# EasyEDA schematic SCH_Bed sensor_2021-08-20.json
TITLE: Bed occupancy sensor; REV: 1.0; Date: 2021-07-02; Sheet: 1/1; Company: Bout sektor
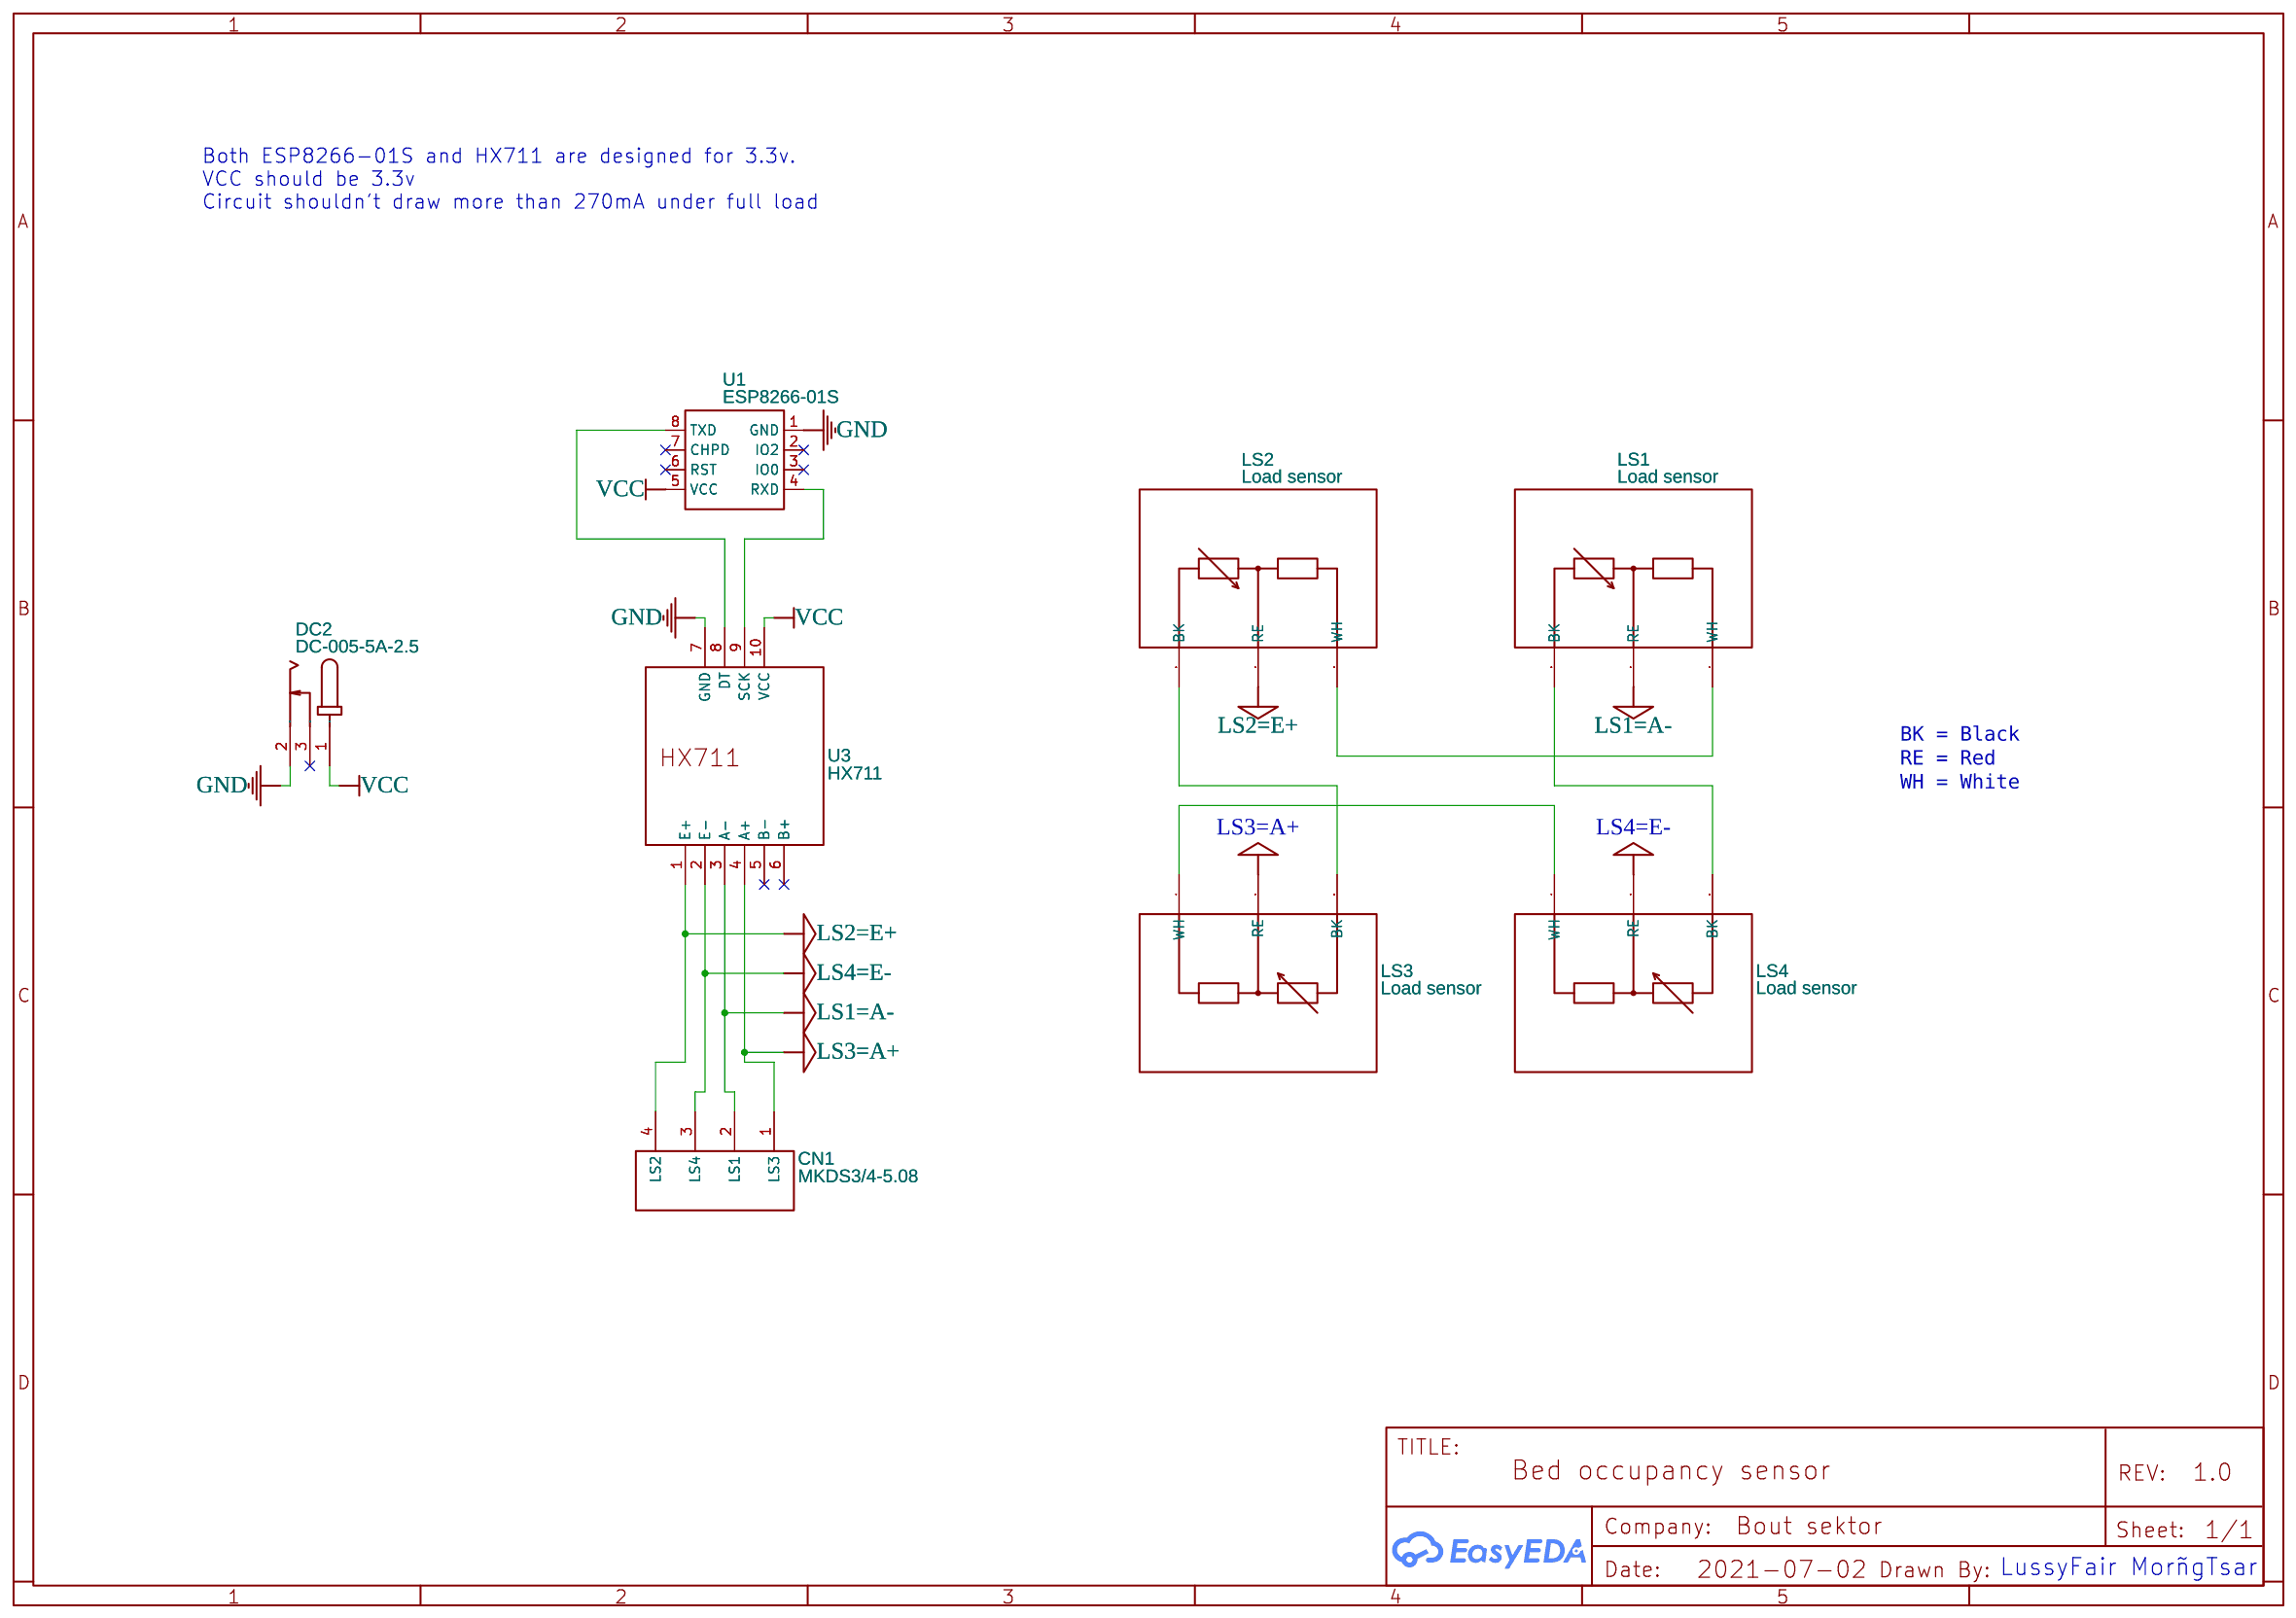
[diagram p0: schematic sheet]

## Parts
CN1  MKDS3/4-5.08  [CONN-TH_4P-P5.08_1712805]
DC2  DC-005-5A-2.5  [DC-IN-TH_DC-005-5A-2.5]
LS1  Load sensor  [CONN-TH_3P-P5.08_1711738]
LS2  Load sensor  [CONN-TH_3P-P5.08_1711738]
LS3  Load sensor  [CONN-TH_3P-P5.08_1711738]
LS4  Load sensor  [CONN-TH_3P-P5.08_1711738]
U1  ESP8266-01S  [ESP-01S]
U3  HX711  [SOP-16_L10.0-W3.9-P1.27-LS6.0-BL]

## Library data of the parts
CN1 = MKDS3/4-5.08: Supplier: LCSC; Manufacturer: Phoenix Contact; Supplier Part: C90087
DC2 = DC-005-5A-2.5: Supplier: LCSC; Supplier Part: C381115; Manufacturer: XKB Enterprise; Contributor: MarvinB
LS1 LS3 = Load sensor: Contributor: VHvozdik; Package Display: No
LS2 LS4 = Load sensor: Contributor: VHvozdik
U1 = ESP8266-01S: Supplier Part: C111009; Supplier: LCSC; Manufacturer: Ai-Thinker; Contributor: javierj
U3 = HX711: Supplier: LCSC; Manufacturer: AVIA; Supplier Part: C43656; Paste Type: Extended Part; JLCPCB Part Class: Extended Part; Contributor: CHAMPTECH

## Nets
GND: DC2.2 U1.1(GND) U3.7(GND)
VCC: DC2.1 U1.5(VCC) U3.10(VCC)
LS1=A-: CN1.2(LS1) LS1.2(RE) U3.3(A-)
LS2=E+: CN1.4(LS2) LS2.2(RE) U3.1(E+)
LS3=A+: CN1.1(LS3) LS3.2(RE) U3.4(A+)
LS4=E-: CN1.3(LS4) LS4.2(RE) U3.2(E-)
Net-(LS1-1): LS1.1(WH) LS2.1(WH)
Net-(LS1-3): LS1.3(BK) LS4.3(BK)
Net-(LS2-3): LS2.3(BK) LS3.3(BK)
Net-(LS3-1): LS3.1(WH) LS4.1(WH)
Net-(U1-4): U1.4(RXD) U3.9(SCK)
Net-(U1-8): U1.8(TXD) U3.8(DT)

Not connected (* = marked no-connect by the designer): DC2 3*; U1 2(IO2)* 3(IO0)* 6(RST)* 7(CHPD)*; U3 5(B-)* 6(B+)*

## Notes on the sheet
- Both ESP8266-01S and HX711 are designed for 3.3v.
  VCC should be 3.3v
  Circuit shouldn't draw more than 270mA under full load
- BK = Black
  RE = Red
  WH = White
- LussyFair MorñgTsar
